# Altium schematic sheet Power.SchDoc
size A4; Revision: D.1(PCB.SCH)
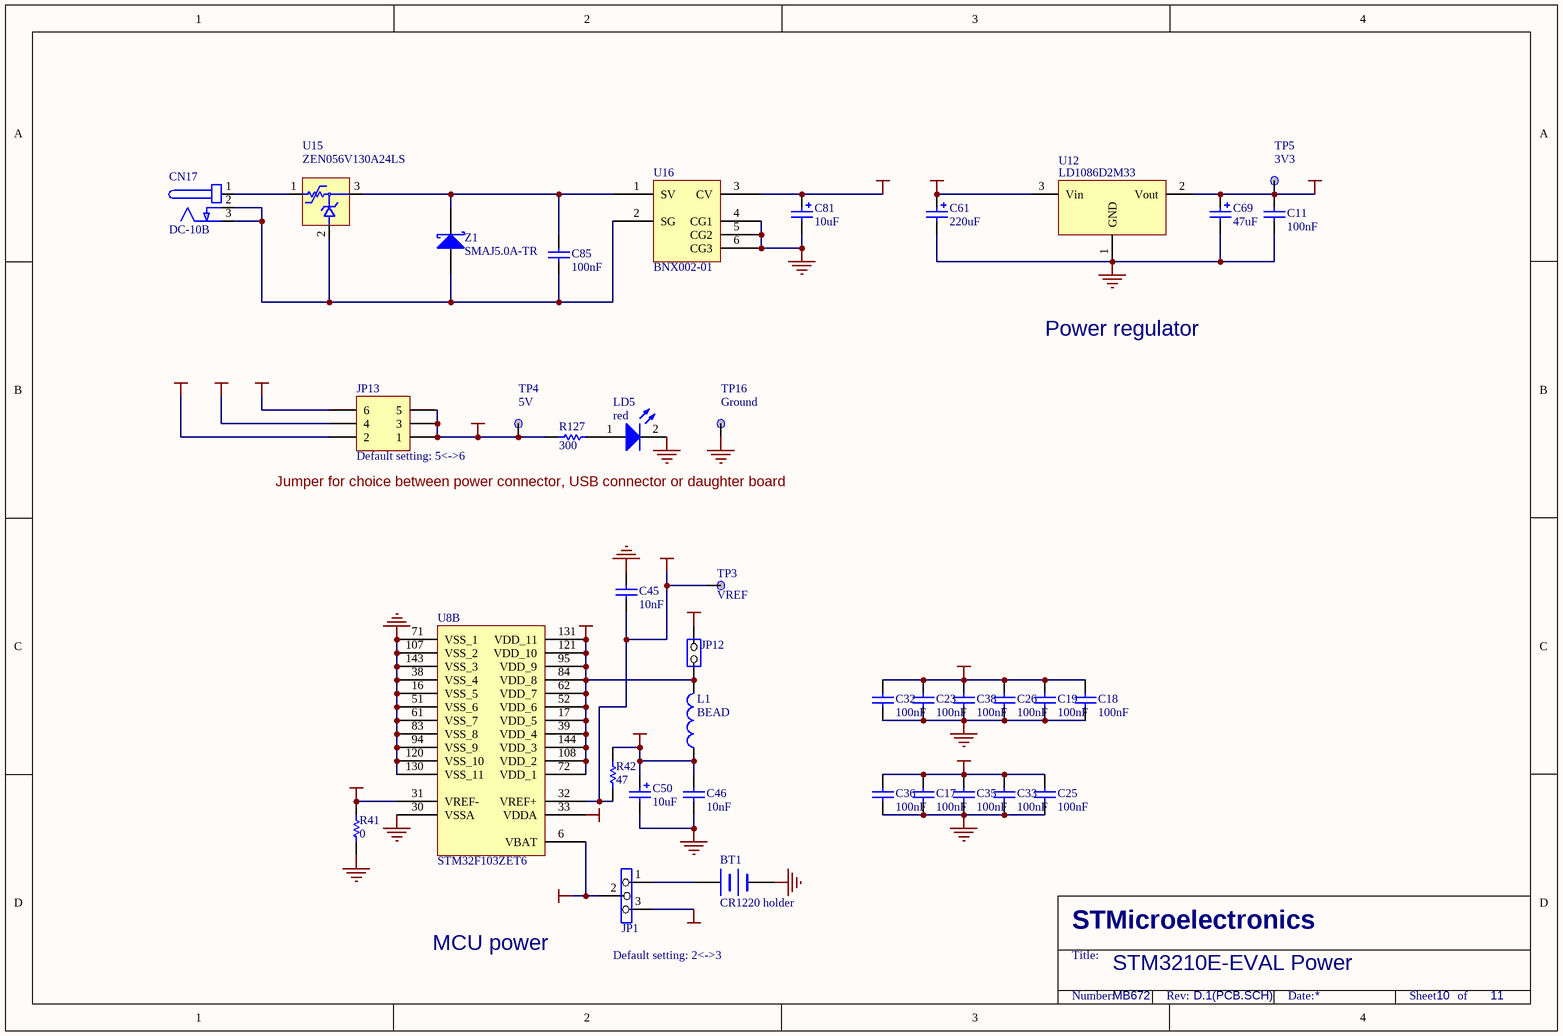
[diagram p0: Power.SchDoc]

## Parts
BT1  CR1220 holder  [BATT]
C11  100nF  [0603P]
C17  100nF  [0603P]
C18  100nF  [0603P]
C19  100nF  [0603P]
C23  100nF  [0603P]
C25  100nF  [0603P]
C26  100nF  [0603P]
C32  100nF  [0603P]
C33  100nF  [0603P]
C35  100nF  [0603P]
C36  100nF  [0603P]
C38  100nF  [0603P]
C45  10nF  [0603]
C46  10nF  [0603]
C50  10uF  [TAN-B]
C61  220uF  [C310M]
C69  47uF  [TAN-B]
C81  10uF  [C160M]
C85  100nF  [0603P]
CN17  DC-10B  [DC10B]
JP1  (no value)  [SIP3]
JP12  (no value)  [SIP2]
JP13  (no value)  [2*3P]
L1  BEAD  [0603]
LD5  red  [D0603]
R41  0  [0805]
R42  47  [0805]
R127  300  [0603]
TP3  VREF  [TP]
TP4  5V  [TP]
TP5  3V3  [TP]
TP16  Ground  [TP]
U8  STM32F103ZET6  (part B of 2)
U12  LD1086D2M33  [D2PAK/A]
U15  ZEN056V130A24LS  [polyzen]
U16  BNX002-01  [BNX001]
Z1  SMAJ5.0A-TR  [1R1C]

## Nets
+3V3: C11.1 C69.1 JP1.3 JP12.2(NO) TP5.1 U12.2(Vout)
+5V: C61.1 JP13.1 JP13.3 JP13.5 R127.2 TP4.1 U12.3(Vin)
D5V: JP13.4
E5V: C81.1 JP13.6 U16.3(CV)
GND: BT1.2(-) C11.2 C17.2 C18.2 C19.2 C23.2 C25.2 C26.2 C32.2 C33.2 C35.2 C36.2 C38.2 C45.2 C46.1 C50.2 C61.2 C69.2 C81.2 LD5.2(K) R41.2 TP16.1 U8.16(VSS_5) U8.30(VSSA) U8.38(VSS_4) U8.51(VSS_6) U8.61(VSS_7) U8.71(VSS_1) U8.83(VSS_8) U8.94(VSS_9) U8.107(VSS_2) U8.120(VSS_10) U8.130(VSS_11) U8.143(VSS_3) U12.1(GND) U16.4(CG1) U16.5(CG2) U16.6(CG3)
U5V: JP13.2
Vbat: JP1.2 U8.6(VBAT)
VDD: C17.1 C18.1 C19.1 C23.1 C25.1 C26.1 C32.1 C33.1 C35.1 C36.1 C38.1 JP12.1(COMMON) L1.2 U8.17(VDD_5) U8.39(VDD_4) U8.52(VDD_6) U8.62(VDD_7) U8.72(VDD_1) U8.84(VDD_8) U8.95(VDD_9) U8.108(VDD_2) U8.121(VDD_10) U8.131(VDD_11) U8.144(VDD_3)
VDDA: C46.2 C50.1 L1.1 R42.2 U8.33(VDDA)
VREF+: C45.1 R42.1 TP3.1 U8.32(VREF+)
VREF-: R41.1 U8.31(VREF-)
NetBT1_1: BT1.1(+) JP1.1
NetC85_1: C85.1 U15.3 U16.1(SV) Z1.2(K)
NetC85_2: C85.2 CN17.2(GND) CN17.3(GND) U15.2 U16.2(SG) Z1.1(A)
NetCN17_1: CN17.1(+) U15.1
NetLD5_1: LD5.1(A) R127.1

## Notes on the sheet
- Power regulator
- Jumper for choice between power connector, USB connector or daughter board
- (near JP13) Default setting: 5<->6
- MCU power
- (near JP1) Default setting: 2<->3
- STM3210E-EVAL Power
- MB672
- 10
- 11
- STMicroelectronics
- Title:
- Number:
- Rev:
- Date:
- Sheet       of

## Library data of the parts
BT1 = BATTERY
C11 = Cap: Capacitor; Value: 10nF; Published: 8-Jun-2000; Revision: July-2002: Re-released for DXP Platform.; Publisher: Altium Limited
C17-C19 C23 C25 C26 C32 C33 C35 C36 C38 = CAP: Capacitor; Published: 8-Jun-2000; Revision: July-2002: Re-released for DXP Platform.; Publisher: Altium Limited; Value: 100nF
C45 C46 = Cap: Capacitor; Published: 8-Jun-2000; Revision: July-2002: Re-released for DXP Platform.; Publisher: Altium Limited; Value: 10nF
C50 = Cap Pol1: Polarized Capacitor (Radial); Published: 8-Jun-2000; Revision: July-2002: Re-released for DXP Platform.; Publisher: Altium Limited; Value: 10uF
C61 C69 = Cap Pol1: Polarized Capacitor (Radial); Value: 10uF; Published: 8-Jun-2000; Revision: July-2002: Re-released for DXP Platform.; Publisher: Altium Limited
C81 = Cap Pol1: Polarized Capacitor (Radial); Value: 47uF; Published: 8-Jun-2000; Revision: July-2002: Re-released for DXP Platform.; Publisher: Altium Limited
C85 = CAP: Capacitor; Value: 100pF; Published: 8-Jun-2000; Revision: July-2002: Re-released for DXP Platform.; Publisher: Altium Limited
CN17 = PJ202A
JP1 = Jumper3
JP12 = JP2
JP13 = Header 3X2: Header, 3-Pin, Dual row; Revision: 17-Jul-2002: Re-released for DXP Platform.; Publisher: Altium Limited
L1 = Inductor: Value: 100uH; Published: 8-Jun-2000; Revision: July-2002: Re-released for DXP Platform.; Publisher: Altium Limited
LD5 = LED2: Typical RED, GREEN, YELLOW, AMBER GaAs LED; Published: 8-Jun-2000; Revision: July-2002: Re-released for DXP Platform.; Publisher: Altium Limited
R41 R42 = Res1: Resistor; Value: 1K; Published: 8-Jun-2000; Revision: July-2002: Re-released for DXP Platform.; Publisher: Altium Limited
R127 = res1: Resistor; Value: 1K; Published: 8-Jun-2000; Revision: July-2002: Re-released for DXP Platform.; Publisher: Altium Limited
TP3-TP5 TP16 = TP
U8 = BigPiranha_new
U12 = VOLTREG1
U16 = BNX002
Z1 = D Schottky: Schottky Diode; Code - JEDEC: DO-214-AA; Published: 8-Jun-2000; Revision: July-2002: Re-released for DXP Platform.; Publisher: Altium Limited